# Altium schematic sheet Main.SchDoc
size A4
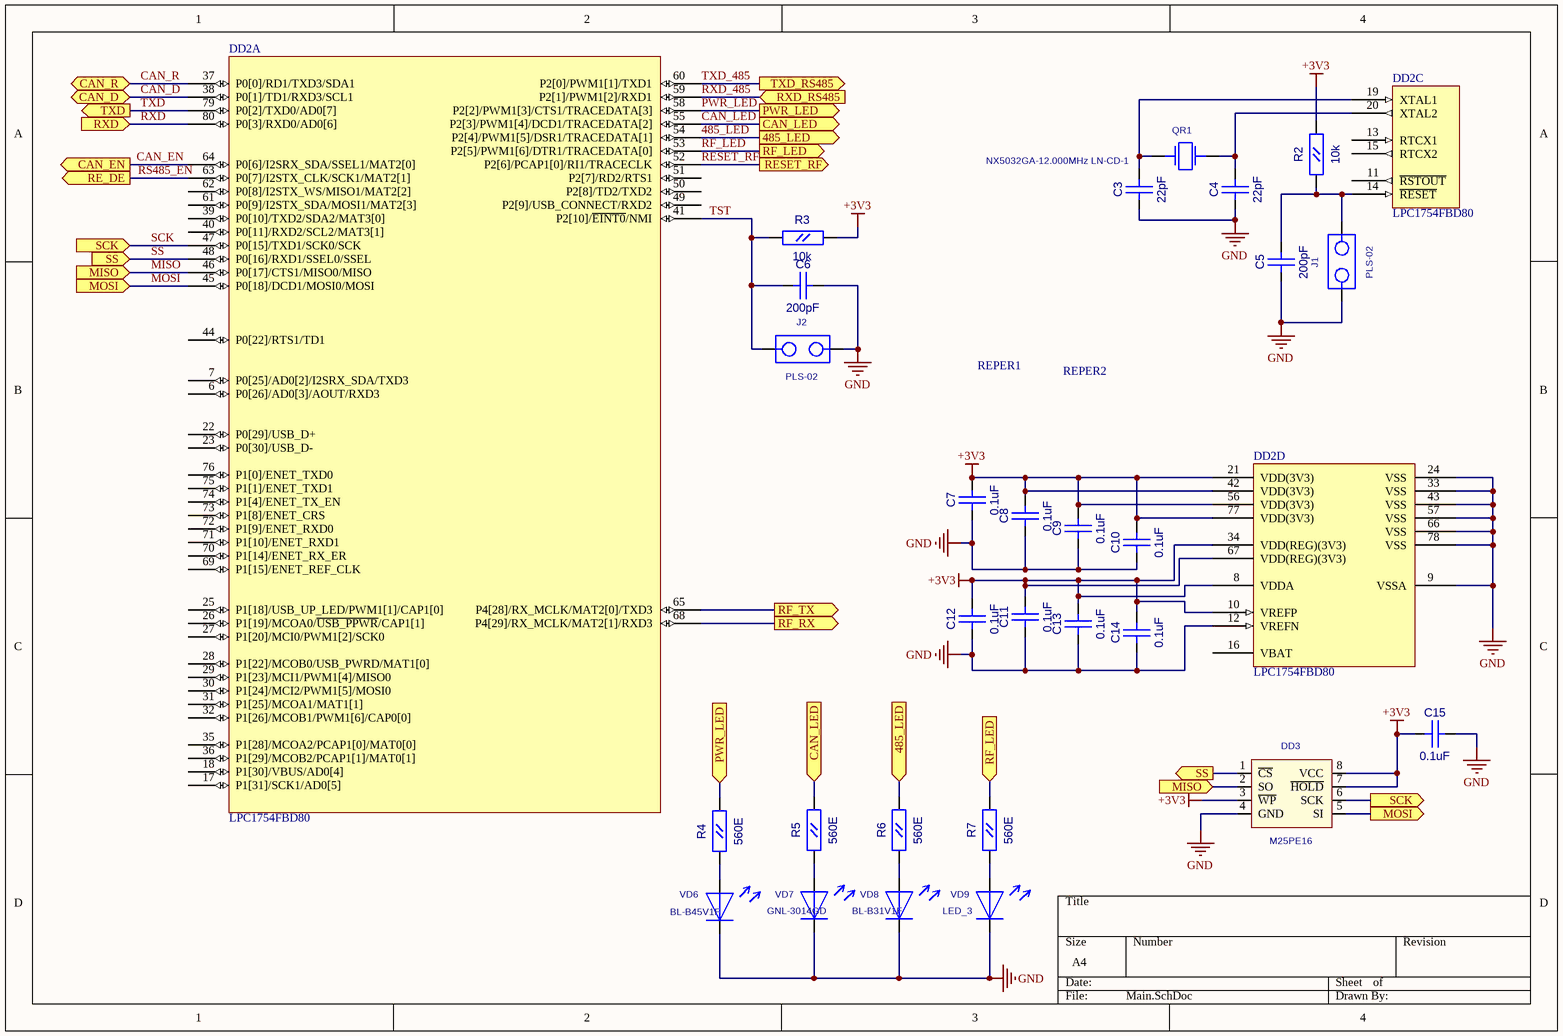
[diagram p0: Main.SchDoc]

## Parts
C3  22pF  [CC0603]
C4  22pF  [CC0603]
C5  200pF  [CC0603]
C6  200pF  [CC0603]
C7  0.1uF  [CC0603]
C8  0.1uF  [CC0603]
C9  0.1uF  [CC0603]
C10  0.1uF  [CC0603]
C11  0.1uF  [CC0603]
C12  0.1uF  [CC0603]
C13  0.1uF  [CC0603]
C14  0.1uF  [CC0603]
C15  0.1uF  [CC0603]
DD2  LPC1754FBD80  [TQFP-80_0.5]  (parts A,C,D of 4)
DD3  M25PE16  [EIAJ_SO8]
J1  PLS-02  [PLS-02]
J2  PLS-02  [PLS-02]
QR1  NX5032GA-12.000MHz LN-CD-1  [AC5032_2]
R2  10k  [RC0603]
R3  10k  [RC0603]
R4  560E  [RC0603]
R5  560E  [RC0603]
R6  560E  [RC0603]
R7  560E  [RC0603]
REPER1  REPER1.2  [REPER1.2]  (value not drawn)
REPER2  REPER1.2  [REPER1.2]  (value not drawn)
VD6  BL-B45V1F  [LED3]
VD7  GNL-3014GD  [LED3]
VD8  BL-B31V1F  [LED3]
VD9  LED_3  [LED3]

## Ports
485_LED (in), 485_LED (out), CAN_D, CAN_EN (out), CAN_LED (in), CAN_LED (out), CAN_R, MISO (in), MOSI (in), MOSI (out), PWR_LED (in), PWR_LED (out), RE_DE (out), RESET_RF (out), RF_LED (in), RF_LED (out), RF_RX (out), RF_TX (out), RXD (in), RXD_RS485 (in), SCK (in), SCK (out), SS (in), SS (out), TXD (out), TXD_RS485 (out)

## Nets
+3V3: C7.2(B) C8.2(B) C9.2(B) C10.2(B) C11.2(B) C12.2(B) C13.2(B) C14.2(B) C15.1(A) DD2.8(VDDA) DD2.10(VREFP) DD2.21(VDD(3V3)) DD2.34(VDD(REG)(3V3)) DD2.42(VDD(3V3)) DD2.56(VDD(3V3)) DD2.67(VDD(REG)(3V3)) DD2.77(VDD(3V3)) DD3.3(~{WP}) DD3.7(~{HOLD}) DD3.8(VCC) R2.2(B) R3.2(B)
GND: C3.1(A) C4.1(A) C5.1(A) C6.2(B) C7.1(A) C8.1(A) C9.1(A) C10.1(A) C11.1(A) C12.1(A) C13.1(A) C14.1(A) C15.2(B) DD2.9(VSSA) DD2.12(VREFN) DD2.24(VSS) DD2.33(VSS) DD2.43(VSS) DD2.57(VSS) DD2.66(VSS) DD2.78(VSS) DD3.4(GND) J1.1 J2.2 VD6.1 VD7.1 VD8.1 VD9.1
485_LED: DD2.54(P2[4]/PWM1[5]/DSR1/TRACEDATA[1]) R6.2(B) ; port 485_LED
CAN_D: DD2.38(P0[1]/TD1/RXD3/SCL1) ; port CAN_D
CAN_EN: DD2.64(P0[6]/I2SRX_SDA/SSEL1/MAT2[0]) ; port CAN_EN
CAN_LED: DD2.55(P2[3]/PWM1[4]/DCD1/TRACEDATA[2]) R5.2(B) ; port CAN_LED
CAN_R: DD2.37(P0[0]/RD1/TXD3/SDA1) ; port CAN_R
MISO: DD2.46(P0[17]/CTS1/MISO0/MISO) DD3.2(SO) ; port MISO
MOSI: DD2.45(P0[18]/DCD1/MOSI0/MOSI) DD3.5(SI) ; port MOSI
PWR_LED: DD2.58(P2[2]/PWM1[3]/CTS1/TRACEDATA[3]) R4.2(B) ; port PWR_LED
RESET_RF: DD2.52(P2[6]/PCAP1[0]/RI1/TRACECLK) ; port RESET_RF
RF_LED: DD2.53(P2[5]/PWM1[6]/DTR1/TRACEDATA[0]) R7.2(B) ; port RF_LED
RF_RX: DD2.68(P4[29]/RX_MCLK/MAT2[1]/RXD3) ; port RF_RX
RF_TX: DD2.65(P4[28]/RX_MCLK/MAT2[0]/TXD3) ; port RF_TX
RS485_EN: DD2.63(P0[7]/I2STX_CLK/SCK1/MAT2[1]) ; port RE_DE
RXD: DD2.80(P0[3]/RXD0/AD0[6]) ; port RXD
RXD_485: DD2.59(P2[1]/PWM1[2]/RXD1) ; port RXD_RS485
SCK: DD2.47(P0[15]/TXD1/SCK0/SCK) DD3.6(SCK) ; port SCK
SS: DD2.48(P0[16]/RXD1/SSEL0/SSEL) DD3.1(~{CS}) ; port SS
TST: C6.1(A) DD2.41(P2[10]/~{EINT0}/NMI) J2.1 R3.1(A)
TXD: DD2.79(P0[2]/TXD0/AD0[7]) ; port TXD
TXD_485: DD2.60(P2[0]/PWM1[1]/TXD1) ; port TXD_RS485
NetC3_2: C3.2(B) DD2.19(XTAL1) QR1.1
NetC4_2: C4.2(B) DD2.20(XTAL2) QR1.2
NetC5_2: C5.2(B) DD2.14(~{RESET}) J1.2 R2.1(A)
NetR4_1: R4.1(A) VD6.2
NetR5_1: R5.1(A) VD7.2
NetR6_1: R6.1(A) VD8.2
NetR7_1: R7.1(A) VD9.2

Not connected (* = marked no-connect by the designer): DD2 6(P0[26]/AD0[3]/AOUT/RXD3) 7(P0[25]/AD0[2]/I2SRX_SDA/TXD3) 11(~{RSTOUT}) 13(RTCX1) 15(RTCX2) 16(VBAT) 17(P1[31]/SCK1/AD0[5]) 18(P1[30]/VBUS/AD0[4]) 22(P0[29]/USB_D+) 23(P0[30]/USB_D-) 25(P1[18]/USB_UP_LED/PWM1[1]/CAP1[0]) 26(P1[19]/MCOA0/~{USB_PPWR}/CAP1[1]) 27(P1[20]/MCI0/PWM1[2]/SCK0) 28(P1[22]/MCOB0/USB_PWRD/MAT1[0]) 29(P1[23]/MCI1/PWM1[4]/MISO0) 30(P1[24]/MCI2/PWM1[5]/MOSI0) 31(P1[25]/MCOA1/MAT1[1]) 32(P1[26]/MCOB1/PWM1[6]/CAP0[0]) 35(P1[28]/MCOA2/PCAP1[0]/MAT0[0]) 36(P1[29]/MCOB2/PCAP1[1]/MAT0[1]) 39(P0[10]/TXD2/SDA2/MAT3[0]) 40(P0[11]/RXD2/SCL2/MAT3[1]) 44(P0[22]/RTS1/TD1) 49(P2[9]/USB_CONNECT/RXD2) 50(P2[8]/TD2/TXD2) 51(P2[7]/RD2/RTS1) 61(P0[9]/I2STX_SDA/MOSI1/MAT2[3]) 62(P0[8]/I2STX_WS/MISO1/MAT2[2]) 69(P1[15]/ENET_REF_CLK) 70(P1[14]/ENET_RX_ER) 71(P1[10]/ENET_RXD1) 72(P1[9]/ENET_RXD0) 73(P1[8]/ENET_CRS) 74(P1[4]/ENET_TX_EN) 75(P1[1]/ENET_TXD1) 76(P1[0]/ENET_TXD0); REPER1 1; REPER2 1

## Library data of the parts
C3-C15 = CC0603
  C3 C4: Value: 22pF
  C5 C6: Value: 200pF
  C7-C15: Value: 0.1uF
DD2 = LPC1754FBD80: Cortex -M3 32-Bit Microcontroller, 128KB Flash, 64KB RAM, 800-Lead LQFP; ComponentLink1Description: Manufacturer Link; ComponentLink1URL: http://www.nxp.com/
DD3 = S25FL016A0LMFI01: Value: M25PE16
QR1 = AC5032_2: AC5032/2; Value: NX5032GA-12.000MHz LN-CD-1
R2-R7 = RC0603
  R2 R3: Value: 10k
  R4-R7: Value: 560E
VD6-VD8 = LED_3
  VD6: Value: BL-B45V1F
  VD7: Value: GNL-3014GD
  VD8: Value: BL-B31V1F
J1 J2 = PLS-02: Value: *
REPER1 REPER2 = REPER1.2: Value: *
VD9 = LED_3: Value: *